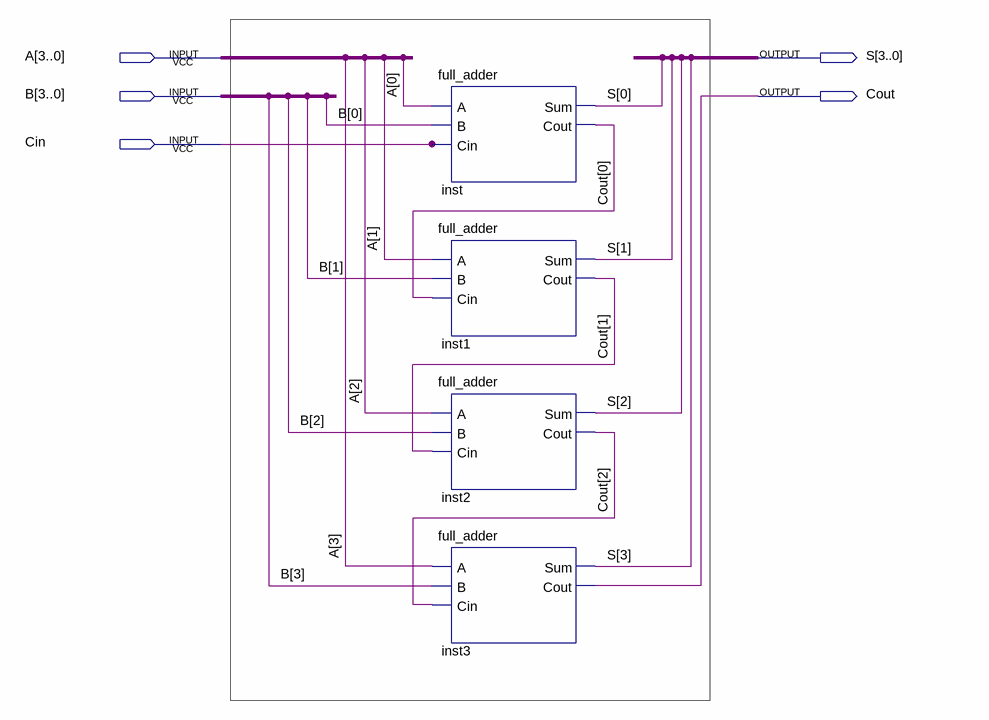
[diagram p0: schematic sheet]
// Quartus schematic full_adder_4b.bdf as structural Verilog: 4 symbols, 5 pins
module full_adder_4b (
  input  [3:0] A,
  input  [3:0] B,
  input  Cin,
  output [3:0] S,
  output Cout
);

  wire [2:0] Cout_bus;

  full_adder inst (.A(A[0]), .B(B[0]), .Cin(Cin), .Sum(S[0]), .Cout(Cout_bus[0]));
  full_adder inst1 (.A(A[1]), .B(B[1]), .Cin(Cout_bus[0]), .Sum(S[1]), .Cout(Cout_bus[1]));
  full_adder inst2 (.A(A[2]), .B(B[2]), .Cin(Cout_bus[1]), .Sum(S[2]), .Cout(Cout_bus[2]));
  full_adder inst3 (.A(A[3]), .B(B[3]), .Cin(Cout_bus[2]), .Sum(S[3]), .Cout(Cout));
endmodule
